# EAGLE schematic pandaLight (EAGLE 6.6.0)
DATABASE: ./../universal-eagle/partsdb.txt

## Sheet 1 of 9: Power
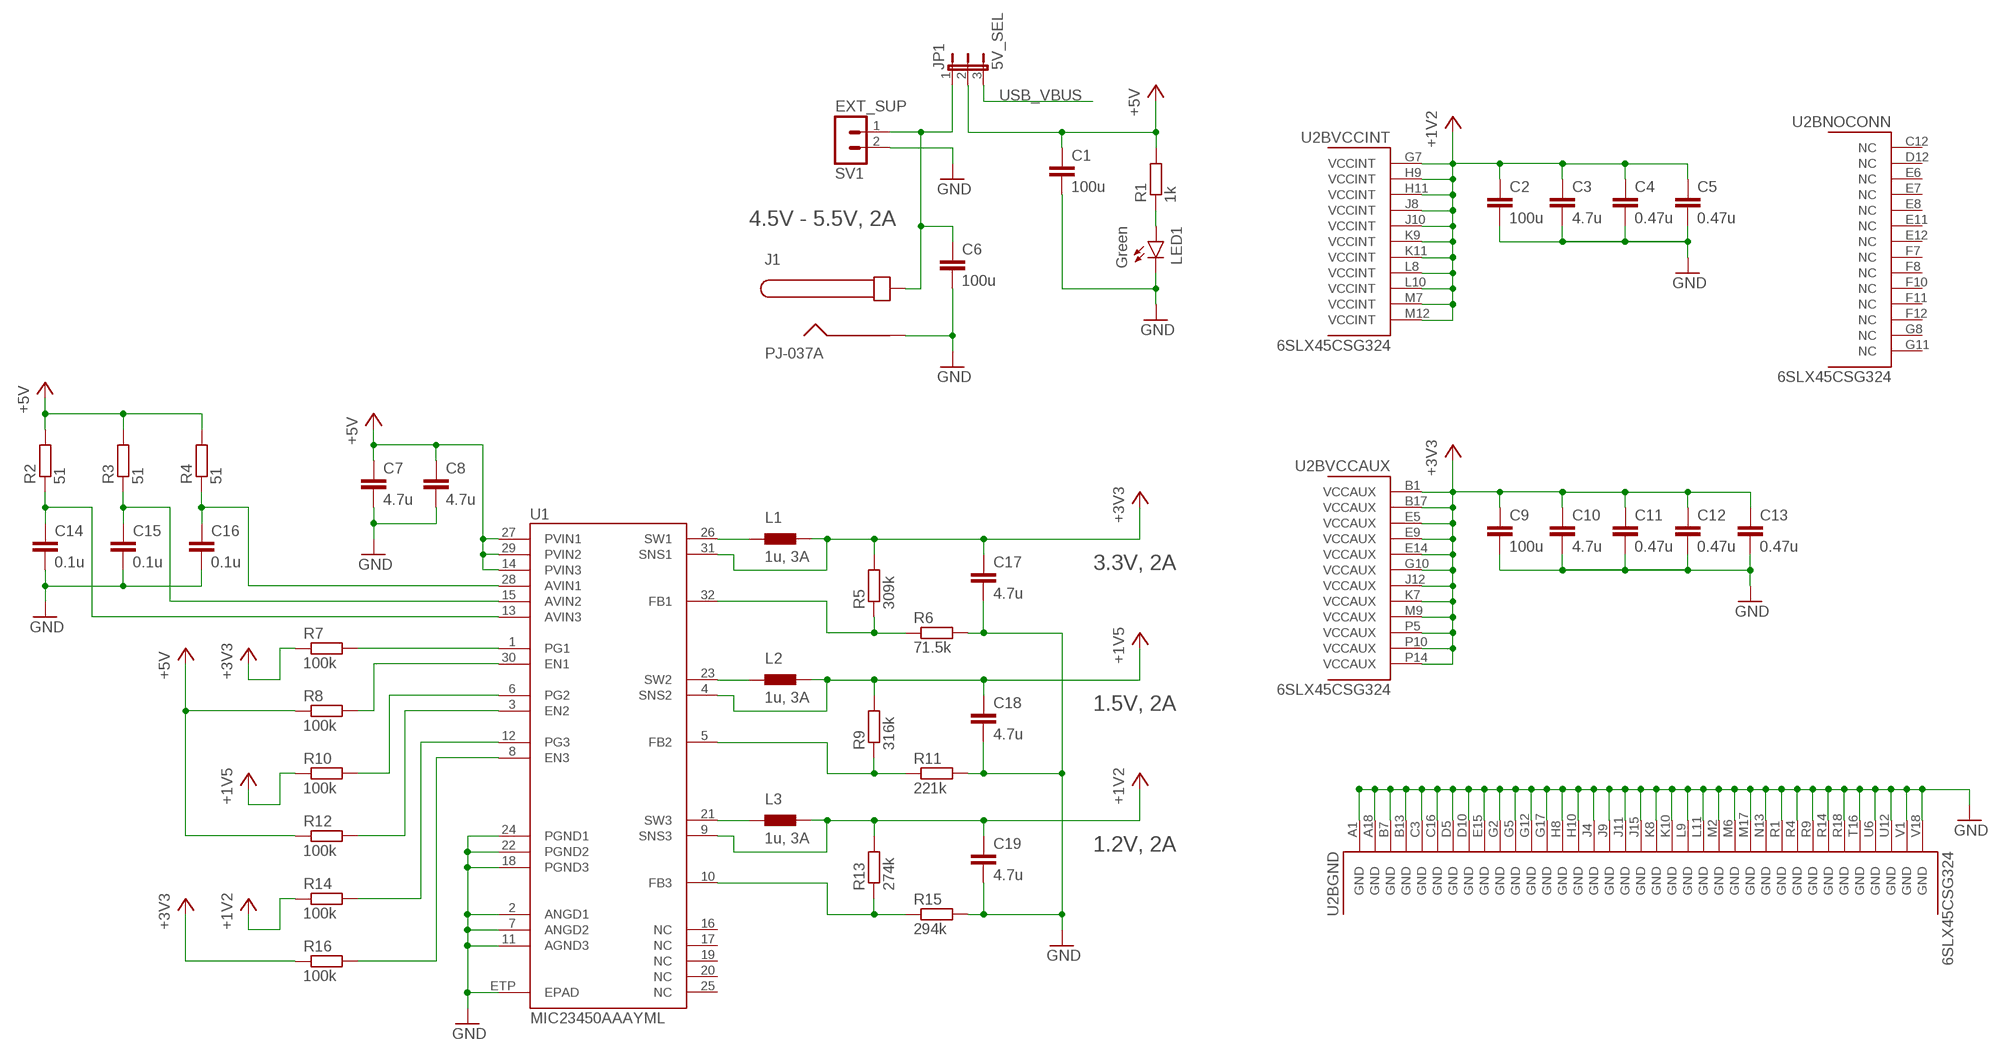
[diagram p0: schematic, sheet 1]

### Parts
C1  100u  CAPACITOR1206  [1206]
C2  100u  CAPACITOR1206  [1206]
C3  4.7u  CAPACITOR0603  [0603]
C4  0.47u  CAPACITOR0402  [0402]
C5  0.47u  CAPACITOR0402  [0402]
C6  100u  CAPACITOR1206  [1206]
C7  4.7u  CAPACITOR0603  [0603]
C8  4.7u  CAPACITOR0603  [0603]
C9  100u  CAPACITOR1206  [1206]
C10  4.7u  CAPACITOR0603  [0603]
C11  0.47u  CAPACITOR0402  [0402]
C12  0.47u  CAPACITOR0402  [0402]
C13  0.47u  CAPACITOR0402  [0402]
C14  0.1u  CAPACITOR0402  [0402]
C15  0.1u  CAPACITOR0402  [0402]
C16  0.1u  CAPACITOR0402  [0402]
C17  4.7u  CAPACITOR0603  [0603]
C18  4.7u  CAPACITOR0603  [0603]
C19  4.7u  CAPACITOR0603  [0603]
J1  PJ-037A  [PJ-037A]
JP1  5V_SEL  JP2E  [JP2]
L1  1u, 3A  INDUCTOR1008  [1008]
L2  1u, 3A  INDUCTOR1008  [1008]
L3  1u, 3A  INDUCTOR1008  [1008]
LED1  Green  LED0603  [LED-0603]
R1  1k  RESISTOR0402  [0402]
R2  51  RESISTOR0402  [0402]
R3  51  RESISTOR0402  [0402]
R4  51  RESISTOR0402  [0402]
R5  309k  RESISTOR0402  [0402]
R6  71.5k  RESISTOR0402  [0402]
R7  100k  RESISTOR0402  [0402]
R8  100k  RESISTOR0402  [0402]
R9  316k  RESISTOR0402  [0402]
R10  100k  RESISTOR0402  [0402]
R11  221k  RESISTOR0402  [0402]
R12  100k  RESISTOR0402  [0402]
R13  274k  RESISTOR0402  [0402]
R14  100k  RESISTOR0402  [0402]
R15  294k  RESISTOR0402  [0402]
R16  100k  RESISTOR0402  [0402]
SV1  EXT_SUP  MA02-1  [MA02-1]
U1  MIC23450AAAYML  [QFN-32-5X5]
U2  6SLX45CSG324  [CS324]

### Nets
+1V2: C2.1 C3.1 C4.1 C5.1 C19.1 L3.2 R13.2 R14.1 U1.9(SNS3) U2.G7(BVCCINT:VCCINT) U2.H9(BVCCINT:VCCINT) U2.H11(BVCCINT:VCCINT) U2.J8(BVCCINT:VCCINT) U2.J10(BVCCINT:VCCINT) U2.K9(BVCCINT:VCCINT) U2.K11(BVCCINT:VCCINT) U2.L8(BVCCINT:VCCINT) U2.L10(BVCCINT:VCCINT) U2.M7(BVCCINT:VCCINT) U2.M12(BVCCINT:VCCINT)
+1V5: C18.1 L2.2 R9.2 R10.1 U1.4(SNS2) ; also sheet 6
+3V3 [power]: C9.1 C10.1 C11.1 C12.1 C13.1 C17.1 L1.2 R5.2 R7.1 R16.1 U1.31(SNS1) U2.B1(BVCCAUX:VCCAUX) U2.B17(BVCCAUX:VCCAUX) U2.E5(BVCCAUX:VCCAUX) U2.E9(BVCCAUX:VCCAUX) U2.E14(BVCCAUX:VCCAUX) U2.G10(BVCCAUX:VCCAUX) U2.J12(BVCCAUX:VCCAUX) U2.K7(BVCCAUX:VCCAUX) U2.M9(BVCCAUX:VCCAUX) U2.P5(BVCCAUX:VCCAUX) U2.P10(BVCCAUX:VCCAUX) U2.P14(BVCCAUX:VCCAUX) ; also sheet 2,3,4,5,7,8,9
+5V [power]: C1.1 C7.1 C8.1 JP1.2 R1.2 R2.2 R3.2 R4.2 R8.1 R12.1 U1.14(PVIN3) U1.27(PVIN1) U1.29(PVIN2) ; also sheet 3,4,5,7
CENTER [power]: C6.1 J1.CENTER JP1.1 SV1.1
GND: C1.2 C2.2 C3.2 C4.2 C5.2 C6.2 C7.2 C8.2 C9.2 C10.2 C11.2 C12.2 C13.2 C14.2 C15.2 C16.2 C17.2 C18.2 C19.2 J1.BARREL LED1.C R6.2 R11.2 R15.2 SV1.2 U1.2(ANGD1) U1.7(ANGD2) U1.11(AGND3) U1.18(PGND3) U1.22(PGND2) U1.24(PGND1) U1.ETP(EPAD) U2.A1(BGND:GND) U2.A18(BGND:GND) U2.B7(BGND:GND) U2.B13(BGND:GND) U2.C3(BGND:GND) U2.C16(BGND:GND) U2.D5(BGND:GND) U2.D10(BGND:GND) U2.E15(BGND:GND) U2.G2(BGND:GND) U2.G5(BGND:GND) U2.G12(BGND:GND) U2.G17(BGND:GND) U2.H8(BGND:GND) U2.H10(BGND:GND) U2.J4(BGND:GND) U2.J9(BGND:GND) U2.J11(BGND:GND) U2.J15(BGND:GND) U2.K8(BGND:GND) U2.K10(BGND:GND) U2.L9(BGND:GND) U2.L11(BGND:GND) U2.M2(BGND:GND) U2.M6(BGND:GND) U2.M17(BGND:GND) U2.N13(BGND:GND) U2.R1(BGND:GND) U2.R4(BGND:GND) U2.R9(BGND:GND) U2.R14(BGND:GND) U2.R18(BGND:GND) U2.T16(BGND:GND) U2.U6(BGND:GND) U2.U12(BGND:GND) U2.V1(BGND:GND) U2.V18(BGND:GND) ; also sheet 2,3,4,5,6,7,8,9
N$14: L1.1 U1.26(SW1)
N$15 [power]: C16.1 R4.1 U1.28(AVIN1)
N$16: L2.1 U1.23(SW2)
N$17: L3.1 U1.21(SW3)
N$18: R13.1 R15.1 U1.10(FB3)
N$20: R10.2 U1.6(PG2)
N$21: R5.1 R6.1 U1.32(FB1)
N$22: R7.2 U1.1(PG1)
N$23: R9.1 R11.1 U1.5(FB2)
N$24: R12.2 U1.3(EN2)
N$25: R8.2 U1.30(EN1)
N$26: R14.2 U1.12(PG3)
N$27: R16.2 U1.8(EN3)
N$30 [power]: C15.1 R3.1 U1.15(AVIN2)
N$47: LED1.A R1.1
N$48 [power]: C14.1 R2.1 U1.13(AVIN3)
USB_VBUS [power]: JP1.3 ; also sheet 2
Unconnected: U1.16(NC) U1.17(NC) U1.19(NC) U1.20(NC) U1.25(NC) U2.C12(BNOCONN:NC) U2.D12(BNOCONN:NC) U2.E6(BNOCONN:NC) U2.E7(BNOCONN:NC) U2.E8(BNOCONN:NC) U2.E11(BNOCONN:NC) U2.E12(BNOCONN:NC) U2.F7(BNOCONN:NC) U2.F8(BNOCONN:NC) U2.F10(BNOCONN:NC) U2.F11(BNOCONN:NC) U2.F12(BNOCONN:NC) U2.G8(BNOCONN:NC) U2.G11(BNOCONN:NC)

### Notes on the sheet
- 4.5V - 5.5V, 2A
- 3.3V, 2A
- 1.5V, 2A
- 1.2V, 2A

## Sheet 2 of 9: USB
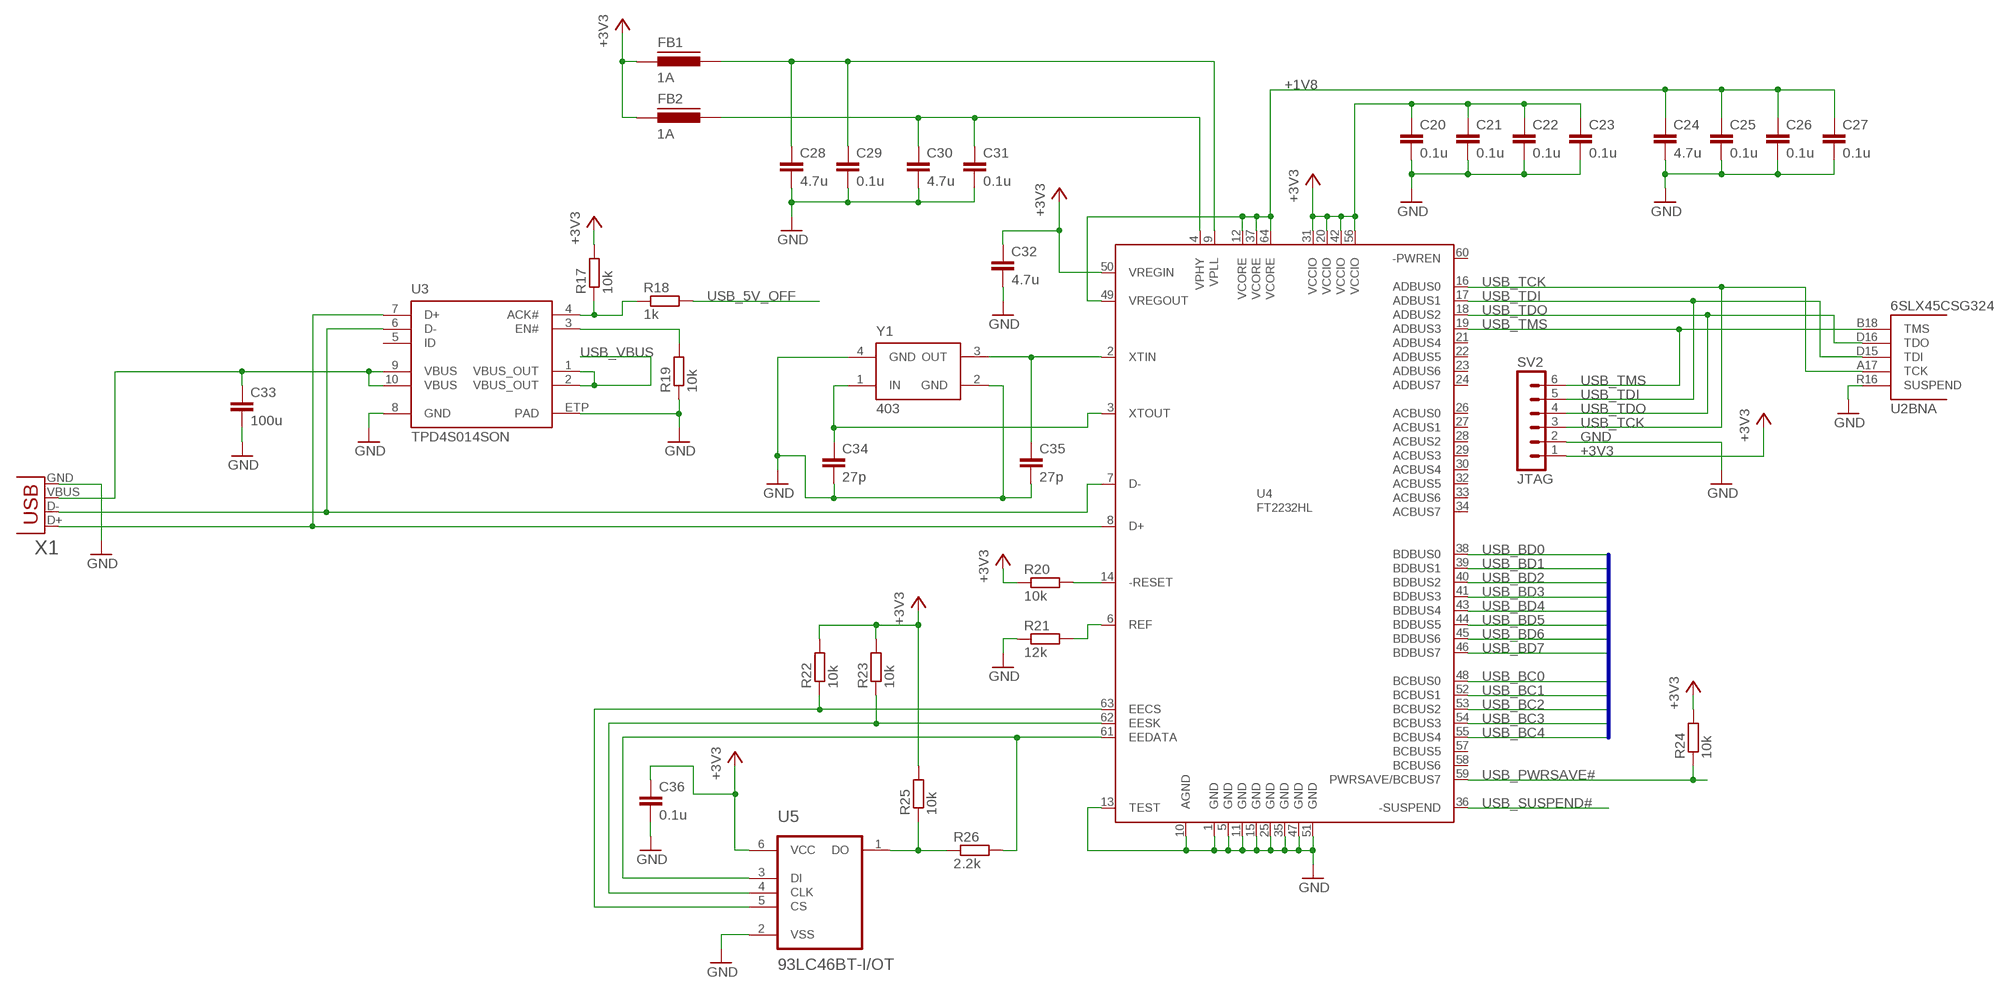
[diagram p1: schematic, sheet 2]

### Parts
C20  0.1u  CAPACITOR0402  [0402]
C21  0.1u  CAPACITOR0402  [0402]
C22  0.1u  CAPACITOR0402  [0402]
C23  0.1u  CAPACITOR0402  [0402]
C24  4.7u  CAPACITOR0603  [0603]
C25  0.1u  CAPACITOR0402  [0402]
C26  0.1u  CAPACITOR0402  [0402]
C27  0.1u  CAPACITOR0402  [0402]
C28  4.7u  CAPACITOR0603  [0603]
C29  0.1u  CAPACITOR0402  [0402]
C30  4.7u  CAPACITOR0603  [0603]
C31  0.1u  CAPACITOR0402  [0402]
C32  4.7u  CAPACITOR0603  [0603]
C33  100u  CAPACITOR1206  [1206]
C34  27p  CAPACITOR0402  [0402]
C35  27p  CAPACITOR0402  [0402]
C36  0.1u  CAPACITOR0402  [0402]
FB1  1A  FERRITE0402  [0402]
FB2  1A  FERRITE0402  [0402]
R17  10k  RESISTOR0402  [0402]
R18  1k  RESISTOR0402  [0402]
R19  10k  RESISTOR0402  [0402]
R20  10k  RESISTOR0402  [0402]
R21  12k  RESISTOR0402  [0402]
R22  10k  RESISTOR0402  [0402]
R23  10k  RESISTOR0402  [0402]
R24  10k  RESISTOR0402  [0402]
R25  10k  RESISTOR0402  [0402]
R26  2.2k  RESISTOR0402  [0402]
SV2  JTAG  MA06-1  [MA06-1]
U3  TPD4S014SON  [SON10]
U4  FT2232HL  [LQFP64]
U5  93LC46BT-I/OT  [SOT23-6]
X1  USBUB-S  [USB-UB-S]
Y1  403  [403-3.2X2.5]

### Nets
+1V8 [power]: C24.1 C25.1 C26.1 C27.1 U4.12(VCORE) U4.37(VCORE) U4.49(VREGOUT) U4.64(VCORE)
+3V3 [power]: C20.1 C21.1 C22.1 C23.1 C32.1 C36.1 FB1.1 FB2.1 R17.2 R20.1 R22.2 R23.2 R24.2 R25.2 SV2.1 U4.20(VCCIO) U4.31(VCCIO) U4.42(VCCIO) U4.50(VREGIN) U4.56(VCCIO) U5.6(VCC) ; also sheet 1,3,4,5,7,8,9
GND: C20.2 C21.2 C22.2 C23.2 C24.2 C25.2 C26.2 C27.2 C28.2 C29.2 C30.2 C31.2 C32.2 C33.2 C34.2 C35.2 C36.2 R19.1 R21.1 SV2.2 U2.R16(BNA:SUSPEND) U3.8(GND) U3.ETP(PAD) U4.1(GND) U4.5(GND) U4.10(AGND) U4.11(GND) U4.13(TEST) U4.15(GND) U4.25(GND) U4.35(GND) U4.47(GND) U4.51(GND) U5.2(VSS) X1.GND Y1.2(GND) Y1.4(GND) ; also sheet 1,3,4,5,6,7,8,9
N$1: C35.1 U4.2(XTIN) Y1.3(OUT)
N$5: C34.1 U4.3(XTOUT) Y1.1(IN)
N$6: R22.1 U4.63(EECS) U5.5(CS)
N$7: U3.6(D-) U4.7(D-) X1.D-
N$8: U3.7(D+) U4.8(D+) X1.D+
N$9: R23.1 U4.62(EESK) U5.4(CLK)
N$10: R26.2 U4.61(EEDATA) U5.3(DI)
N$11: R21.2 U4.6(REF)
N$12: R25.1 R26.1 U5.1(DO)
N$13: R20.2 U4.14(-RESET)
N$28: C30.1 C31.1 FB2.2 U4.4(VPHY)
N$31: C28.1 C29.1 FB1.2 U4.9(VPLL)
N$45 [vbus]: C33.1 U3.9(VBUS) U3.10(VBUS) X1.VBUS
USB_5V_ACK#: R17.1 R18.1 U3.4(ACK#)
USB_5V_DISABLE: R19.2 U3.3(EN#)
USB_5V_OFF: R18.2 ; also sheet 4
USB_BC0: U4.48(BCBUS0)
USB_BC1: U4.52(BCBUS1)
USB_BC2: U4.53(BCBUS2)
USB_BC3: U4.54(BCBUS3)
USB_BC4: U4.55(BCBUS4)
USB_BD0: U4.38(BDBUS0)
USB_BD1: U4.39(BDBUS1)
USB_BD2: U4.40(BDBUS2)
USB_BD3: U4.41(BDBUS3)
USB_BD4: U4.43(BDBUS4)
USB_BD5: U4.44(BDBUS5)
USB_BD6: U4.45(BDBUS6)
USB_BD7: U4.46(BDBUS7)
USB_PWRSAVE#: R24.1 U4.59(PWRSAVE/BCBUS7)
USB_SUSPEND#: U4.36(-SUSPEND) ; also sheet 4
USB_TCK: SV2.3 U2.A17(BNA:TCK) U4.16(ADBUS0)
USB_TDI: SV2.5 U2.D15(BNA:TDI) U4.17(ADBUS1)
USB_TDO: SV2.4 U2.D16(BNA:TDO) U4.18(ADBUS2)
USB_TMS: SV2.6 U2.B18(BNA:TMS) U4.19(ADBUS3)
USB_VBUS [power]: U3.1(VBUS_OUT) U3.2(VBUS_OUT) ; also sheet 1
Unconnected: U3.5(ID) U4.21(ADBUS4) U4.22(ADBUS5) U4.23(ADBUS6) U4.24(ADBUS7) U4.26(ACBUS0) U4.27(ACBUS1) U4.28(ACBUS2) U4.29(ACBUS3) U4.30(ACBUS4) U4.32(ACBUS5) U4.33(ACBUS6) U4.34(ACBUS7) U4.57(BCBUS5) U4.58(BCBUS6) U4.60(-PWREN)

### Buses
USB_BD[0..7],USB_BC[0..4]

## Sheet 3 of 9: B0, HDMI Rx0
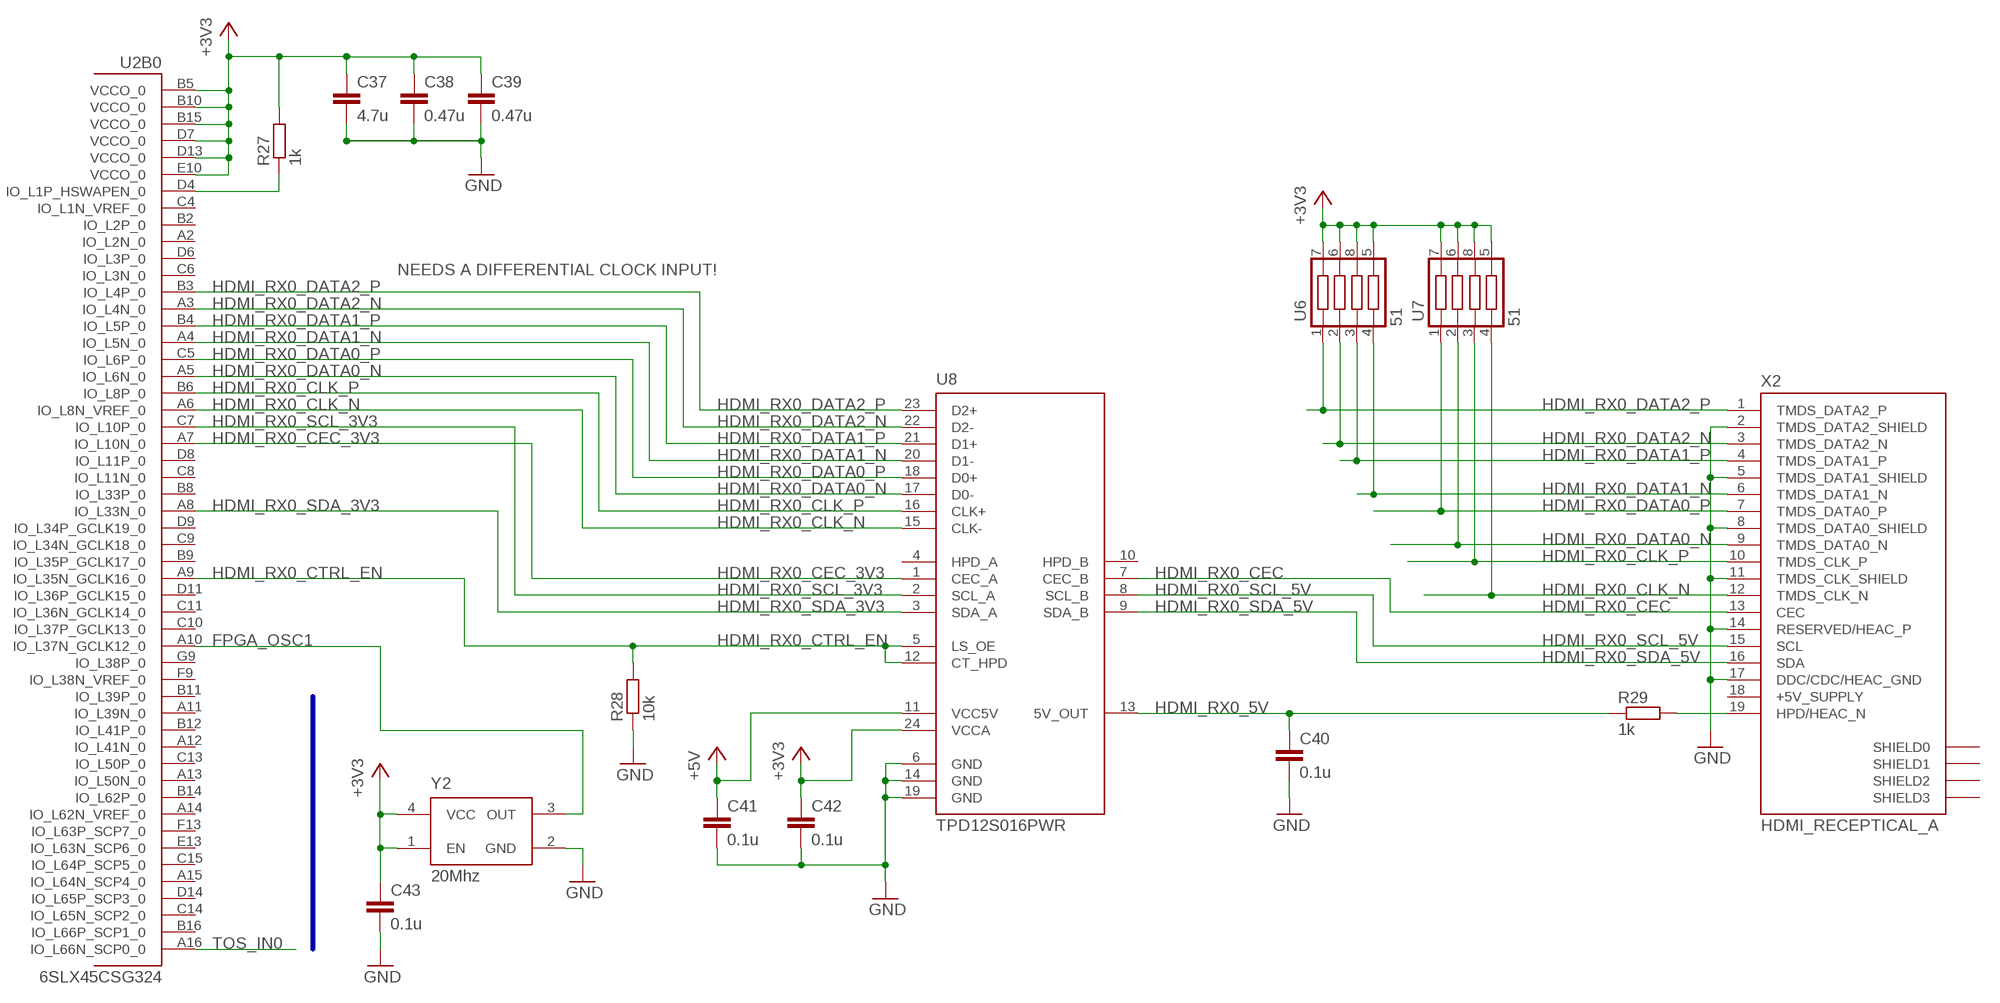
[diagram p2: schematic, sheet 3]

### Parts
C37  4.7u  CAPACITOR0603  [0603]
C38  0.47u  CAPACITOR0402  [0402]
C39  0.47u  CAPACITOR0402  [0402]
C40  0.1u  CAPACITOR0402  [0402]
C41  0.1u  CAPACITOR0402  [0402]
C42  0.1u  CAPACITOR0402  [0402]
C43  0.1u  CAPACITOR0402  [0402]
R27  1k  RESISTOR0402  [0402]
R28  10k  RESISTOR0402  [0402]
R29  1k  RESISTOR0402  [0402]
U6  51  741C083  [741C083]
U7  51  741C083  [741C083]
U8  TPD12S016PWR  [PW_R-PDSO-G24]
X2  HDMI_RECEPTICAL_A  [HDMI_TYPE_A_RECEPTICAL]
Y2  20Mhz  636  [636]

### Nets
+3V3 [power]: C37.1 C38.1 C39.1 C42.1 C43.1 R27.2 U2.B5(B0:VCCO_0) U2.B10(B0:VCCO_0) U2.B15(B0:VCCO_0) U2.D7(B0:VCCO_0) U2.D13(B0:VCCO_0) U2.E10(B0:VCCO_0) U6.5 U6.6 U6.7 U6.8(C3) U7.5 U7.6 U7.7 U7.8(C3) U8.24(VCCA) Y2.1(EN) Y2.4(VCC) ; also sheet 1,2,4,5,7,8,9
+5V [power]: C41.1 U8.11(VCC5V) ; also sheet 1,4,5,7
FPGA_OSC1: U2.A10(B0:IO_L37N_GCLK12_0) Y2.3(OUT)
GND: C37.2 C38.2 C39.2 C40.2 C41.2 C42.2 C43.2 R28.1 U8.6(GND) U8.14(GND) U8.19(GND) X2.2(TMDS_DATA2_SHIELD) X2.5(TMDS_DATA1_SHIELD) X2.8(TMDS_DATA0_SHIELD) X2.11(TMDS_CLK_SHIELD) X2.14(RESERVED/HEAC_P) X2.17(DDC/CDC/HEAC_GND) Y2.2(GND) ; also sheet 1,2,4,5,6,7,8,9
HDMI_RX0_5V: C40.1 R29.1 U8.13(5V_OUT)
HDMI_RX0_CEC: U8.7(CEC_B) X2.13(CEC)
HDMI_RX0_CEC_3V3: U2.A7(B0:IO_L10N_0) U8.1(CEC_A)
HDMI_RX0_CLK_N [tmds]: U2.A6(B0:IO_L8N_VREF_0) U7.4 U8.15(CLK-) X2.12(TMDS_CLK_N)
HDMI_RX0_CLK_P [tmds]: U2.B6(B0:IO_L8P_0) U7.3 U8.16(CLK+) X2.10(TMDS_CLK_P)
HDMI_RX0_CTRL_EN: R28.2 U2.A9(B0:IO_L35N_GCLK16_0) U8.5(LS_OE) U8.12(CT_HPD)
HDMI_RX0_DATA0_N [tmds]: U2.A5(B0:IO_L6N_0) U7.2 U8.17(D0-) X2.9(TMDS_DATA0_N)
HDMI_RX0_DATA0_P [tmds]: U2.C5(B0:IO_L6P_0) U7.1 U8.18(D0+) X2.7(TMDS_DATA0_P)
HDMI_RX0_DATA1_N [tmds]: U2.A4(B0:IO_L5N_0) U6.4 U8.20(D1-) X2.6(TMDS_DATA1_N)
HDMI_RX0_DATA1_P [tmds]: U2.B4(B0:IO_L5P_0) U6.3 U8.21(D1+) X2.4(TMDS_DATA1_P)
HDMI_RX0_DATA2_N [tmds]: U2.A3(B0:IO_L4N_0) U6.2 U8.22(D2-) X2.3(TMDS_DATA2_N)
HDMI_RX0_DATA2_P [tmds]: U2.B3(B0:IO_L4P_0) U6.1 U8.23(D2+) X2.1(TMDS_DATA2_P)
HDMI_RX0_SCL_3V3: U2.C7(B0:IO_L10P_0) U8.2(SCL_A)
HDMI_RX0_SCL_5V: U8.8(SCL_B) X2.15(SCL)
HDMI_RX0_SDA_3V3: U2.A8(B0:IO_L33N_0) U8.3(SDA_A)
HDMI_RX0_SDA_5V: U8.9(SDA_B) X2.16(SDA)
N$35: R27.1 U2.D4(B0:IO_L1P_HSWAPEN_0)
N$50: R29.2 X2.19(HPD/HEAC_N)
TOS_IN0: U2.A16(B0:IO_L66N_SCP0_0) ; also sheet 8
Unconnected: U2.A2(B0:IO_L2N_0) U2.A11(B0:IO_L39N_0) U2.A12(B0:IO_L41N_0) U2.A13(B0:IO_L50N_0) U2.A14(B0:IO_L62N_VREF_0) U2.A15(B0:IO_L64N_SCP4_0) U2.B2(B0:IO_L2P_0) U2.B8(B0:IO_L33P_0) U2.B9(B0:IO_L35P_GCLK17_0) U2.B11(B0:IO_L39P_0) U2.B12(B0:IO_L41P_0) U2.B14(B0:IO_L62P_0) U2.B16(B0:IO_L66P_SCP1_0) U2.C4(B0:IO_L1N_VREF_0) U2.C6(B0:IO_L3N_0) U2.C8(B0:IO_L11N_0) U2.C9(B0:IO_L34N_GCLK18_0) U2.C10(B0:IO_L37P_GCLK13_0) U2.C11(B0:IO_L36N_GCLK14_0) U2.C13(B0:IO_L50P_0) U2.C14(B0:IO_L65N_SCP2_0) U2.C15(B0:IO_L64P_SCP5_0) U2.D6(B0:IO_L3P_0) U2.D8(B0:IO_L11P_0) U2.D9(B0:IO_L34P_GCLK19_0) U2.D11(B0:IO_L36P_GCLK15_0) U2.D14(B0:IO_L65P_SCP3_0) U2.E13(B0:IO_L63N_SCP6_0) U2.F9(B0:IO_L38N_VREF_0) U2.F13(B0:IO_L63P_SCP7_0) U2.G9(B0:IO_L38P_0) U8.4(HPD_A) U8.10(HPD_B) X2.18(+5V_SUPPLY) X2.SHIELD0 X2.SHIELD1 X2.SHIELD2 X2.SHIELD3

### Buses
PMOD0_[0..3],PMOD1_[0..3],PMOD2_[0..3],PMOD3_[0..3]

### Notes on the sheet
- NEEDS A DIFFERENTIAL CLOCK INPUT!

## Sheet 4 of 9: B1, HDMI Rx1
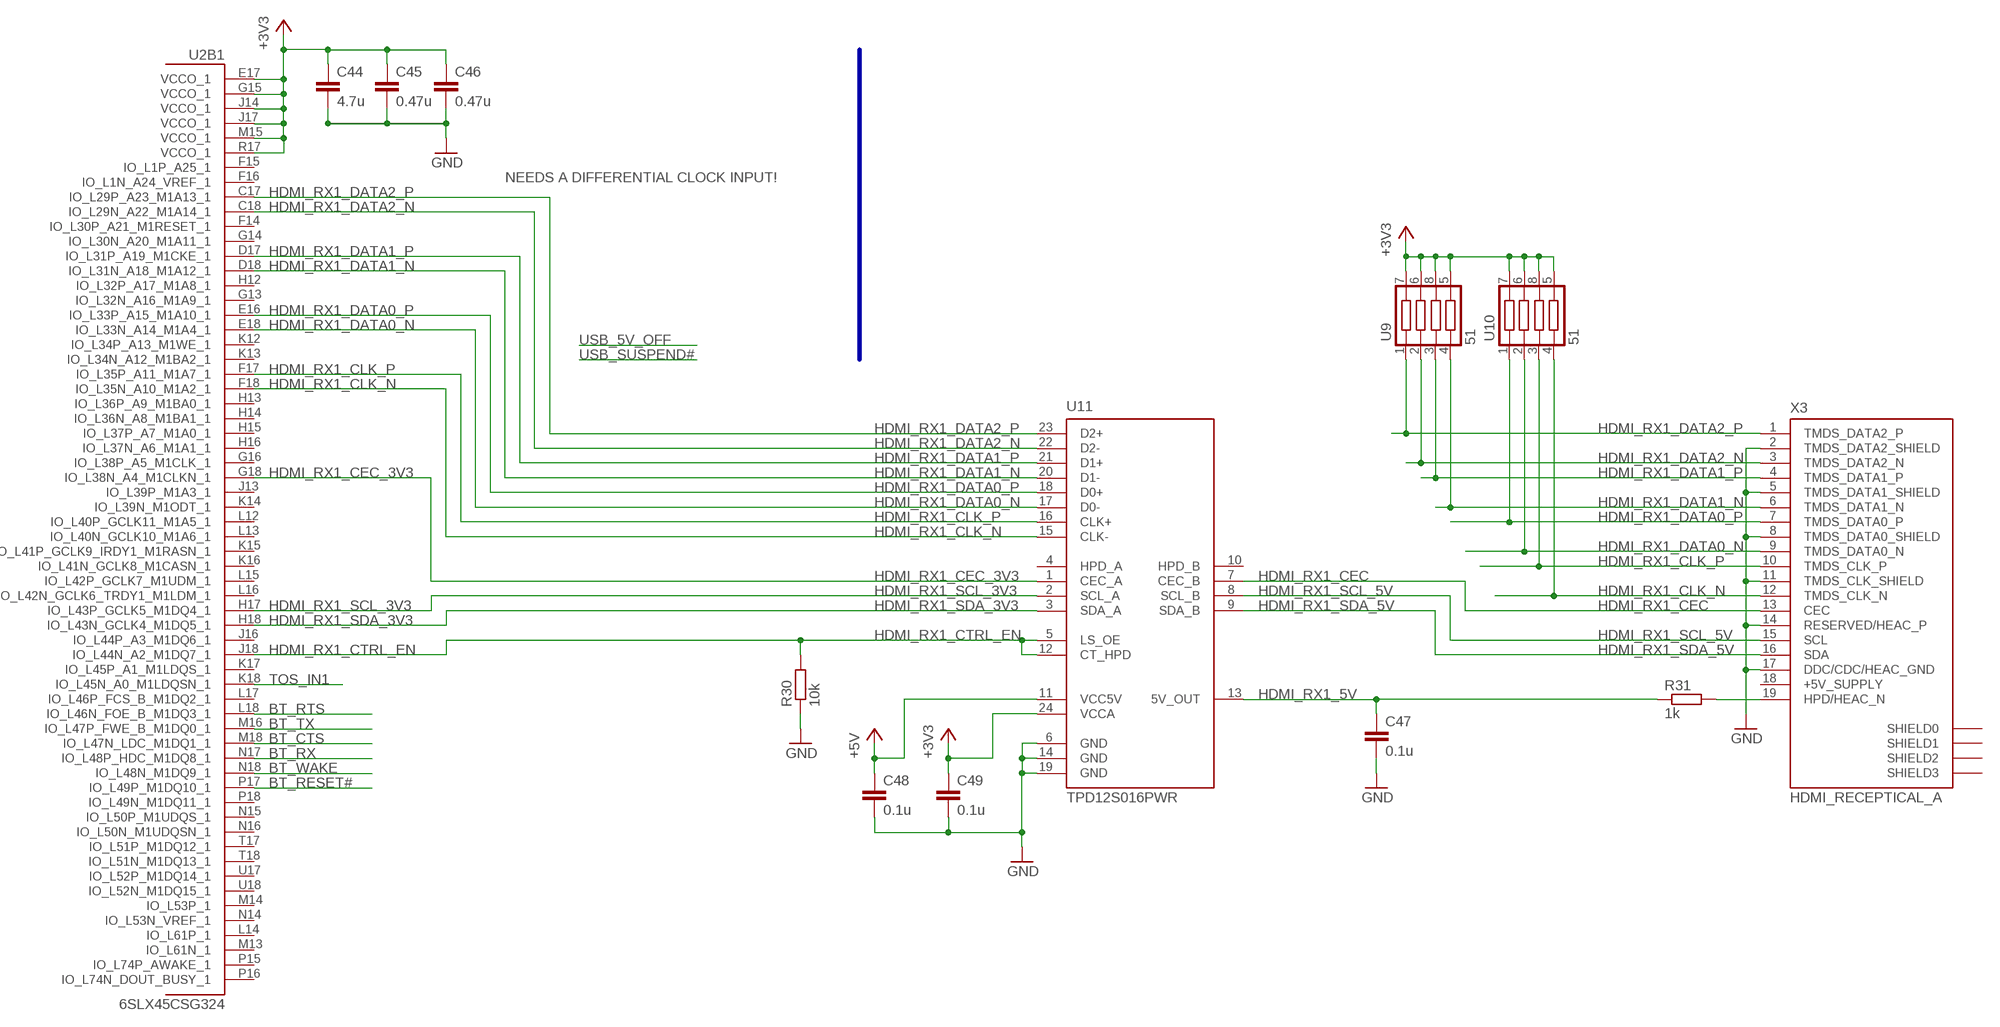
[diagram p3: schematic, sheet 4]

### Parts
C44  4.7u  CAPACITOR0603  [0603]
C45  0.47u  CAPACITOR0402  [0402]
C46  0.47u  CAPACITOR0402  [0402]
C47  0.1u  CAPACITOR0402  [0402]
C48  0.1u  CAPACITOR0402  [0402]
C49  0.1u  CAPACITOR0402  [0402]
R30  10k  RESISTOR0402  [0402]
R31  1k  RESISTOR0402  [0402]
U9  51  741C083  [741C083]
U10  51  741C083  [741C083]
U11  TPD12S016PWR  [PW_R-PDSO-G24]
X3  HDMI_RECEPTICAL_A  [HDMI_TYPE_A_RECEPTICAL]

### Nets
+3V3 [power]: C44.1 C45.1 C46.1 C49.1 U2.E17(B1:VCCO_1) U2.G15(B1:VCCO_1) U2.J14(B1:VCCO_1) U2.J17(B1:VCCO_1) U2.M15(B1:VCCO_1) U2.R17(B1:VCCO_1) U9.5 U9.6 U9.7 U9.8(C3) U10.5 U10.6 U10.7 U10.8(C3) U11.24(VCCA) ; also sheet 1,2,3,5,7,8,9
+5V [power]: C48.1 U11.11(VCC5V) ; also sheet 1,3,5,7
BT_CTS: U2.M18(B1:IO_L47N_LDC_M1DQ1_1) ; also sheet 9
BT_RESET#: U2.P17(B1:IO_L49P_M1DQ10_1) ; also sheet 9
BT_RTS: U2.L18(B1:IO_L46N_FOE_B_M1DQ3_1) ; also sheet 9
BT_RX: U2.N17(B1:IO_L48P_HDC_M1DQ8_1) ; also sheet 9
BT_TX: U2.M16(B1:IO_L47P_FWE_B_M1DQ0_1) ; also sheet 9
BT_WAKE: U2.N18(B1:IO_L48N_M1DQ9_1) ; also sheet 9
GND: C44.2 C45.2 C46.2 C47.2 C48.2 C49.2 R30.1 U11.6(GND) U11.14(GND) U11.19(GND) X3.2(TMDS_DATA2_SHIELD) X3.5(TMDS_DATA1_SHIELD) X3.8(TMDS_DATA0_SHIELD) X3.11(TMDS_CLK_SHIELD) X3.14(RESERVED/HEAC_P) X3.17(DDC/CDC/HEAC_GND) ; also sheet 1,2,3,5,6,7,8,9
HDMI_RX1_5V: C47.1 R31.1 U11.13(5V_OUT)
HDMI_RX1_CEC: U11.7(CEC_B) X3.13(CEC)
HDMI_RX1_CEC_3V3: U2.G18(B1:IO_L38N_A4_M1CLKN_1) U11.1(CEC_A)
HDMI_RX1_CLK_N [tmds]: U2.F18(B1:IO_L35N_A10_M1A2_1) U10.4 U11.15(CLK-) X3.12(TMDS_CLK_N)
HDMI_RX1_CLK_P [tmds]: U2.F17(B1:IO_L35P_A11_M1A7_1) U10.3 U11.16(CLK+) X3.10(TMDS_CLK_P)
HDMI_RX1_CTRL_EN: R30.2 U2.J18(B1:IO_L44N_A2_M1DQ7_1) U11.5(LS_OE) U11.12(CT_HPD)
HDMI_RX1_DATA0_N [tmds]: U2.E18(B1:IO_L33N_A14_M1A4_1) U10.2 U11.17(D0-) X3.9(TMDS_DATA0_N)
HDMI_RX1_DATA0_P [tmds]: U2.E16(B1:IO_L33P_A15_M1A10_1) U10.1 U11.18(D0+) X3.7(TMDS_DATA0_P)
HDMI_RX1_DATA1_N [tmds]: U2.D18(B1:IO_L31N_A18_M1A12_1) U9.4 U11.20(D1-) X3.6(TMDS_DATA1_N)
HDMI_RX1_DATA1_P [tmds]: U2.D17(B1:IO_L31P_A19_M1CKE_1) U9.3 U11.21(D1+) X3.4(TMDS_DATA1_P)
HDMI_RX1_DATA2_N [tmds]: U2.C18(B1:IO_L29N_A22_M1A14_1) U9.2 U11.22(D2-) X3.3(TMDS_DATA2_N)
HDMI_RX1_DATA2_P [tmds]: U2.C17(B1:IO_L29P_A23_M1A13_1) U9.1 U11.23(D2+) X3.1(TMDS_DATA2_P)
HDMI_RX1_SCL_3V3: U2.H17(B1:IO_L43P_GCLK5_M1DQ4_1) U11.2(SCL_A)
HDMI_RX1_SCL_5V: U11.8(SCL_B) X3.15(SCL)
HDMI_RX1_SDA_3V3: U2.H18(B1:IO_L43N_GCLK4_M1DQ5_1) U11.3(SDA_A)
HDMI_RX1_SDA_5V: U11.9(SDA_B) X3.16(SDA)
N$37: R31.2 X3.19(HPD/HEAC_N)
TOS_IN1: U2.K18(B1:IO_L45N_A0_M1LDQSN_1) ; also sheet 8
Unconnected: U2.F14(B1:IO_L30P_A21_M1RESET_1) U2.F15(B1:IO_L1P_A25_1) U2.F16(B1:IO_L1N_A24_VREF_1) U2.G13(B1:IO_L32N_A16_M1A9_1) U2.G14(B1:IO_L30N_A20_M1A11_1) U2.G16(B1:IO_L38P_A5_M1CLK_1) U2.H12(B1:IO_L32P_A17_M1A8_1) U2.H13(B1:IO_L36P_A9_M1BA0_1) U2.H14(B1:IO_L36N_A8_M1BA1_1) U2.H15(B1:IO_L37P_A7_M1A0_1) U2.H16(B1:IO_L37N_A6_M1A1_1) U2.J13(B1:IO_L39P_M1A3_1) U2.J16(B1:IO_L44P_A3_M1DQ6_1) U2.K12(B1:IO_L34P_A13_M1WE_1) U2.K13(B1:IO_L34N_A12_M1BA2_1) U2.K14(B1:IO_L39N_M1ODT_1) U2.K15(B1:IO_L41P_GCLK9_IRDY1_M1RASN_1) U2.K16(B1:IO_L41N_GCLK8_M1CASN_1) U2.K17(B1:IO_L45P_A1_M1LDQS_1) U2.L12(B1:IO_L40P_GCLK11_M1A5_1) U2.L13(B1:IO_L40N_GCLK10_M1A6_1) U2.L14(B1:IO_L61P_1) U2.L15(B1:IO_L42P_GCLK7_M1UDM_1) U2.L16(B1:IO_L42N_GCLK6_TRDY1_M1LDM_1) U2.L17(B1:IO_L46P_FCS_B_M1DQ2_1) U2.M13(B1:IO_L61N_1) U2.M14(B1:IO_L53P_1) U2.N14(B1:IO_L53N_VREF_1) U2.N15(B1:IO_L50P_M1UDQS_1) U2.N16(B1:IO_L50N_M1UDQSN_1) U2.P15(B1:IO_L74P_AWAKE_1) U2.P16(B1:IO_L74N_DOUT_BUSY_1) U2.P18(B1:IO_L49N_M1DQ11_1) U2.T17(B1:IO_L51P_M1DQ12_1) U2.T18(B1:IO_L51N_M1DQ13_1) U2.U17(B1:IO_L52P_M1DQ14_1) U2.U18(B1:IO_L52N_M1DQ15_1) U11.4(HPD_A) U11.10(HPD_B) X3.18(+5V_SUPPLY) X3.SHIELD0 X3.SHIELD1 X3.SHIELD2 X3.SHIELD3

### Buses
USB_BD[0..7],USB_BC[0..4]

### Notes on the sheet
- NEEDS A DIFFERENTIAL CLOCK INPUT!

## Sheet 5 of 9: B2, HDMI Tx0
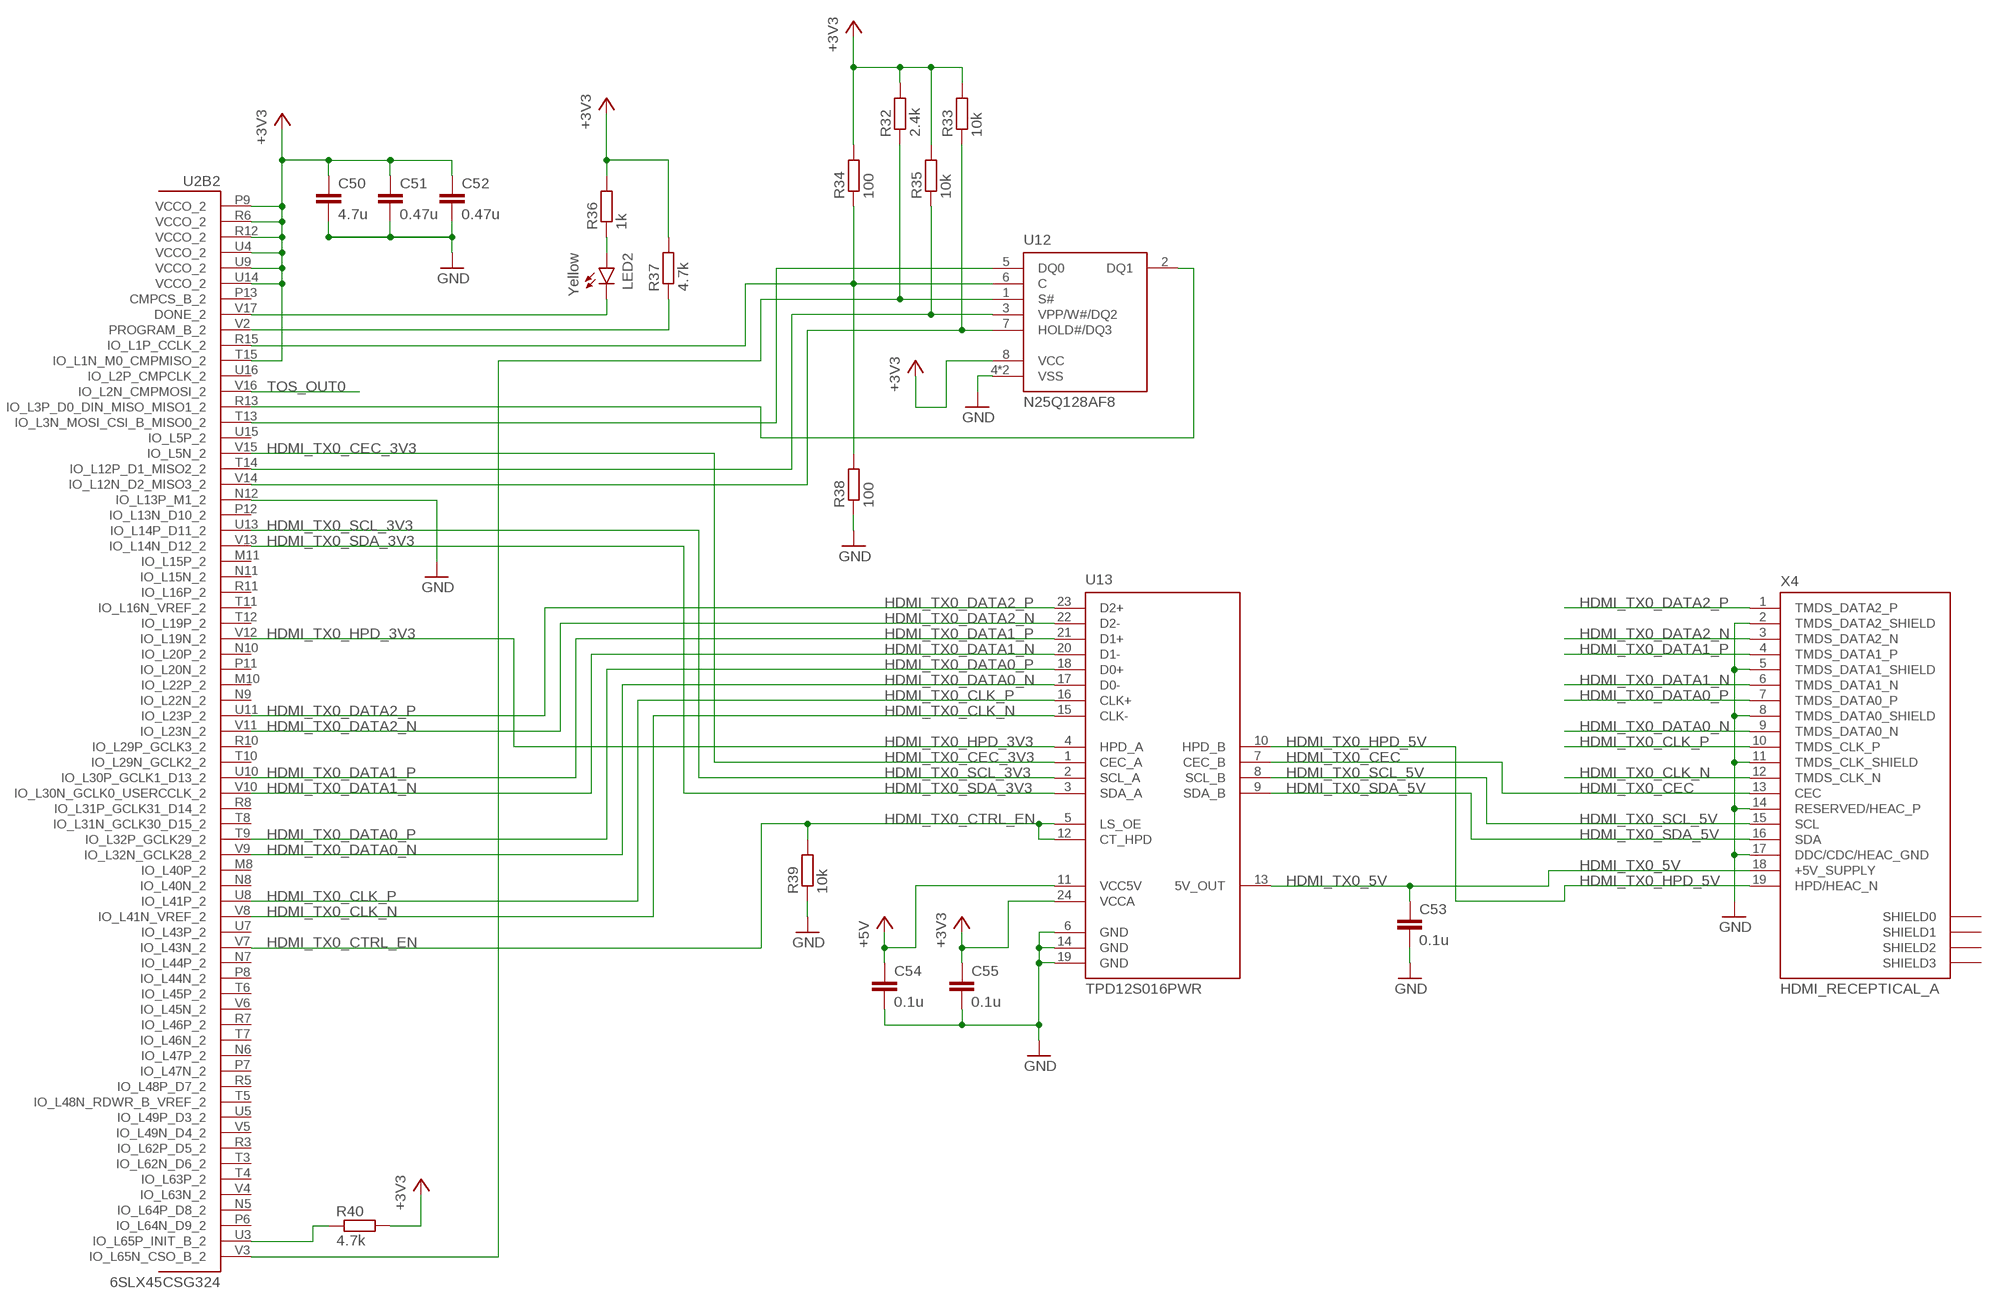
[diagram p4: schematic, sheet 5]

### Parts
C50  4.7u  CAPACITOR0603  [0603]
C51  0.47u  CAPACITOR0402  [0402]
C52  0.47u  CAPACITOR0402  [0402]
C53  0.1u  CAPACITOR0402  [0402]
C54  0.1u  CAPACITOR0402  [0402]
C55  0.1u  CAPACITOR0402  [0402]
LED2  Yellow  LED0603  [LED-0603]
R32  2.4k  RESISTOR0402  [0402]
R33  10k  RESISTOR0402  [0402]
R34  100  RESISTOR0402  [0402]
R35  10k  RESISTOR0402  [0402]
R36  1k  RESISTOR0402  [0402]
R37  4.7k  RESISTOR0402  [0402]
R38  100  RESISTOR0402  [0402]
R39  10k  RESISTOR0402  [0402]
R40  4.7k  RESISTOR0402  [0402]
U12  N25Q128AF8  [V-PDFN-8_8X6]
U13  TPD12S016PWR  [PW_R-PDSO-G24]
X4  HDMI_RECEPTICAL_A  [HDMI_TYPE_A_RECEPTICAL]

### Nets
+3V3 [power]: C50.1 C51.1 C52.1 C55.1 R32.2 R33.2 R34.2 R35.2 R36.2 R37.2 R40.2 U2.P9(B2:VCCO_2) U2.R6(B2:VCCO_2) U2.R12(B2:VCCO_2) U2.T15(B2:IO_L1N_M0_CMPMISO_2) U2.U4(B2:VCCO_2) U2.U9(B2:VCCO_2) U2.U14(B2:VCCO_2) U12.8(VCC) U13.24(VCCA) ; also sheet 1,2,3,4,7,8,9
+5V [power]: C54.1 U13.11(VCC5V) ; also sheet 1,3,4,7
GND: C50.2 C51.2 C52.2 C53.2 C54.2 C55.2 R38.1 R39.1 U2.N12(B2:IO_L13P_M1_2) U12.4(VSS) U12.ETP(VSS) U13.6(GND) U13.14(GND) U13.19(GND) X4.2(TMDS_DATA2_SHIELD) X4.5(TMDS_DATA1_SHIELD) X4.8(TMDS_DATA0_SHIELD) X4.11(TMDS_CLK_SHIELD) X4.14(RESERVED/HEAC_P) X4.17(DDC/CDC/HEAC_GND) ; also sheet 1,2,3,4,6,7,8,9
HDMI_TX0_5V [power]: C53.1 U13.13(5V_OUT) X4.18(+5V_SUPPLY)
HDMI_TX0_CEC: U13.7(CEC_B) X4.13(CEC)
HDMI_TX0_CEC_3V3: U2.V15(B2:IO_L5N_2) U13.1(CEC_A)
HDMI_TX0_CLK_N [tmds]: U2.V8(B2:IO_L41N_VREF_2) U13.15(CLK-) X4.12(TMDS_CLK_N)
HDMI_TX0_CLK_P [tmds]: U2.U8(B2:IO_L41P_2) U13.16(CLK+) X4.10(TMDS_CLK_P)
HDMI_TX0_CTRL_EN: R39.2 U2.V7(B2:IO_L43N_2) U13.5(LS_OE) U13.12(CT_HPD)
HDMI_TX0_DATA0_N [tmds]: U2.V9(B2:IO_L32N_GCLK28_2) U13.17(D0-) X4.9(TMDS_DATA0_N)
HDMI_TX0_DATA0_P [tmds]: U2.T9(B2:IO_L32P_GCLK29_2) U13.18(D0+) X4.7(TMDS_DATA0_P)
HDMI_TX0_DATA1_N [tmds]: U2.V10(B2:IO_L30N_GCLK0_USERCCLK_2) U13.20(D1-) X4.6(TMDS_DATA1_N)
HDMI_TX0_DATA1_P [tmds]: U2.U10(B2:IO_L30P_GCLK1_D13_2) U13.21(D1+) X4.4(TMDS_DATA1_P)
HDMI_TX0_DATA2_N [tmds]: U2.V11(B2:IO_L23N_2) U13.22(D2-) X4.3(TMDS_DATA2_N)
HDMI_TX0_DATA2_P [tmds]: U2.U11(B2:IO_L23P_2) U13.23(D2+) X4.1(TMDS_DATA2_P)
HDMI_TX0_HPD_3V3: U2.V12(B2:IO_L19N_2) U13.4(HPD_A)
HDMI_TX0_HPD_5V: U13.10(HPD_B) X4.19(HPD/HEAC_N)
HDMI_TX0_SCL_3V3: U2.U13(B2:IO_L14P_D11_2) U13.2(SCL_A)
HDMI_TX0_SCL_5V: U13.8(SCL_B) X4.15(SCL)
HDMI_TX0_SDA_3V3: U2.V13(B2:IO_L14N_D12_2) U13.3(SDA_A)
HDMI_TX0_SDA_5V: U13.9(SDA_B) X4.16(SDA)
N$33: LED2.C U2.V17(B2:DONE_2)
N$34: R37.1 U2.V2(B2:PROGRAM_B_2)
N$38: LED2.A R36.1
N$39: R40.1 U2.U3(B2:IO_L65P_INIT_B_2)
N$40: U2.T13(B2:IO_L3N_MOSI_CSI_B_MISO0_2) U12.5(DQ0)
N$41: R32.1 U2.V3(B2:IO_L65N_CSO_B_2) U12.1(S#)
N$42: R34.1 R38.2 U2.R15(B2:IO_L1P_CCLK_2) U12.6(C)
N$43: U2.R13(B2:IO_L3P_D0_DIN_MISO_MISO1_2) U12.2(DQ1)
N$44: R35.1 U2.T14(B2:IO_L12P_D1_MISO2_2) U12.3(VPP/W#/DQ2)
N$46: R33.1 U2.V14(B2:IO_L12N_D2_MISO3_2) U12.7(HOLD#/DQ3)
TOS_OUT0: U2.V16(B2:IO_L2N_CMPMOSI_2) ; also sheet 8
Unconnected: U2.M8(B2:IO_L40P_2) U2.M10(B2:IO_L22P_2) U2.M11(B2:IO_L15P_2) U2.N5(B2:IO_L64P_D8_2) U2.N6(B2:IO_L47P_2) U2.N7(B2:IO_L44P_2) U2.N8(B2:IO_L40N_2) U2.N9(B2:IO_L22N_2) U2.N10(B2:IO_L20P_2) U2.N11(B2:IO_L15N_2) U2.P6(B2:IO_L64N_D9_2) U2.P7(B2:IO_L47N_2) U2.P8(B2:IO_L44N_2) U2.P11(B2:IO_L20N_2) U2.P12(B2:IO_L13N_D10_2) U2.P13(B2:CMPCS_B_2) U2.R3(B2:IO_L62P_D5_2) U2.R5(B2:IO_L48P_D7_2) U2.R7(B2:IO_L46P_2) U2.R8(B2:IO_L31P_GCLK31_D14_2) U2.R10(B2:IO_L29P_GCLK3_2) U2.R11(B2:IO_L16P_2) U2.T3(B2:IO_L62N_D6_2) U2.T4(B2:IO_L63P_2) U2.T5(B2:IO_L48N_RDWR_B_VREF_2) U2.T6(B2:IO_L45P_2) U2.T7(B2:IO_L46N_2) U2.T8(B2:IO_L31N_GCLK30_D15_2) U2.T10(B2:IO_L29N_GCLK2_2) U2.T11(B2:IO_L16N_VREF_2) U2.T12(B2:IO_L19P_2) U2.U5(B2:IO_L49P_D3_2) U2.U7(B2:IO_L43P_2) U2.U15(B2:IO_L5P_2) U2.U16(B2:IO_L2P_CMPCLK_2) U2.V4(B2:IO_L63N_2) U2.V5(B2:IO_L49N_D4_2) U2.V6(B2:IO_L45N_2) X4.SHIELD0 X4.SHIELD1 X4.SHIELD2 X4.SHIELD3

## Sheet 6 of 9: B3, DDR3
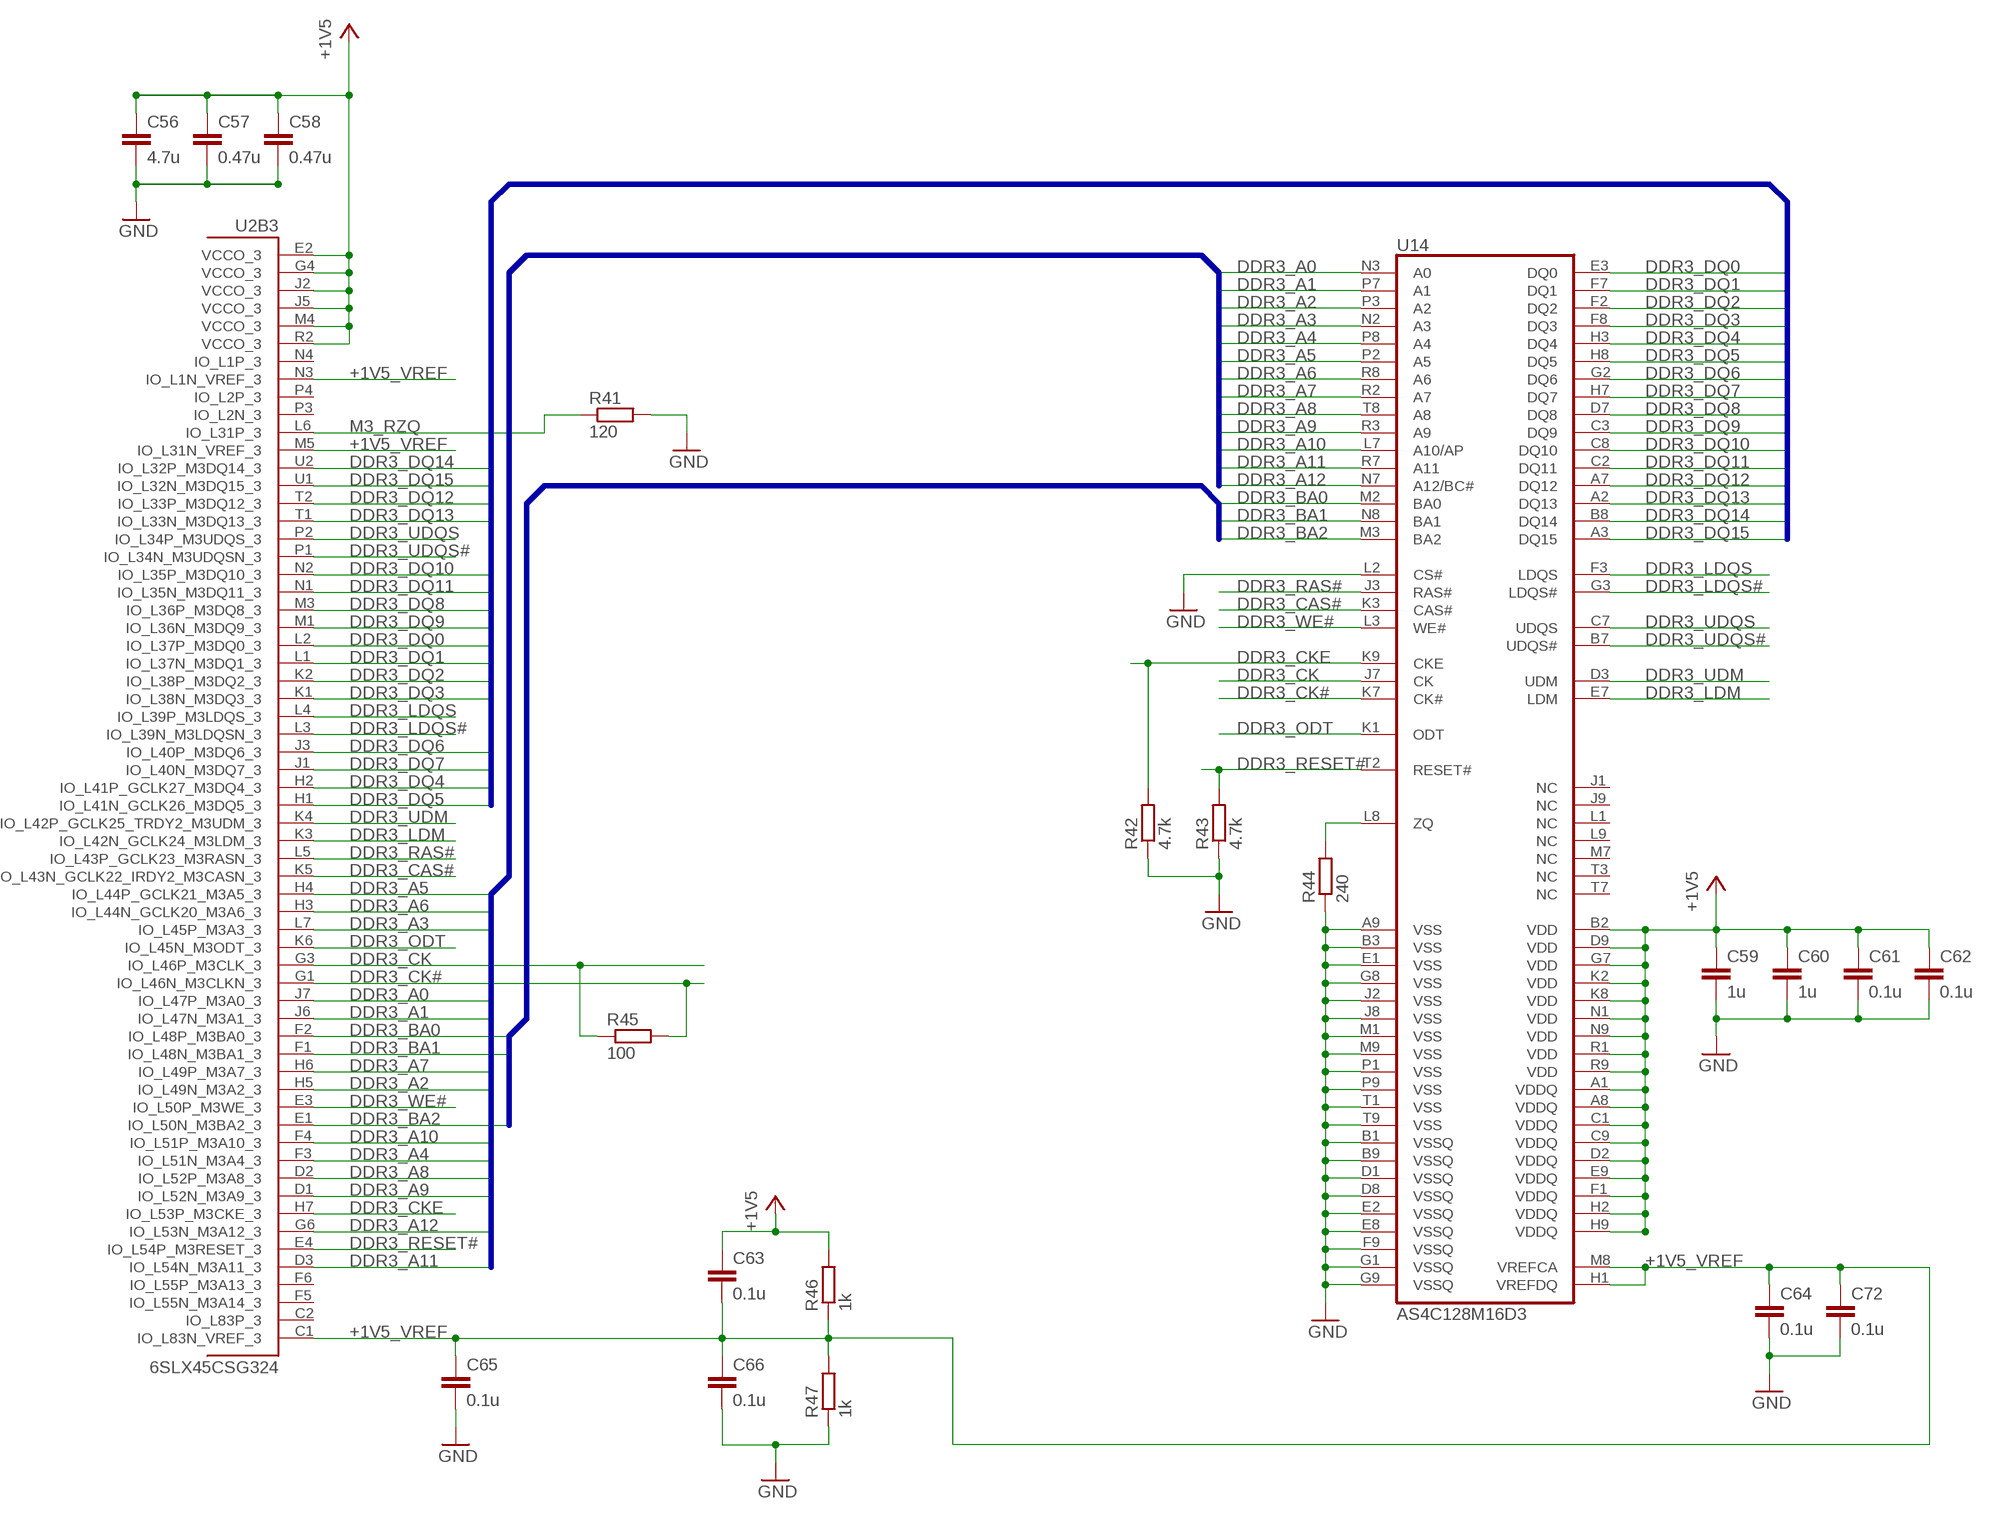
[diagram p5: schematic, sheet 6]

### Parts
C56  4.7u  CAPACITOR0603  [0603]
C57  0.47u  CAPACITOR0402  [0402]
C58  0.47u  CAPACITOR0402  [0402]
C59  1u  CAPACITOR0402  [0402]
C60  1u  CAPACITOR0402  [0402]
C61  0.1u  CAPACITOR0402  [0402]
C62  0.1u  CAPACITOR0402  [0402]
C63  0.1u  CAPACITOR0402  [0402]
C64  0.1u  CAPACITOR0402  [0402]
C65  0.1u  CAPACITOR0402  [0402]
C66  0.1u  CAPACITOR0402  [0402]
C72  0.1u  CAPACITOR0402  [0402]
R41  120  RESISTOR0402  [0402]
R42  4.7k  RESISTOR0402  [0402]
R43  4.7k  RESISTOR0402  [0402]
R44  240  RESISTOR0402  [0402]
R45  100  RESISTOR0402  [0402]
R46  1k  RESISTOR0402  [0402]
R47  1k  RESISTOR0402  [0402]
U14  AS4C128M16D3  [96-FBGA_13X9]

### Nets
+1V5: C56.1 C57.1 C58.1 C59.1 C60.1 C61.1 C62.1 C63.1 R46.2 U2.E2(B3:VCCO_3) U2.G4(B3:VCCO_3) U2.J2(B3:VCCO_3) U2.J5(B3:VCCO_3) U2.M4(B3:VCCO_3) U2.R2(B3:VCCO_3) U14.A1(VDDQ) U14.A8(VDDQ) U14.B2(VDD) U14.C1(VDDQ) U14.C9(VDDQ) U14.D2(VDDQ) U14.D9(VDD) U14.E9(VDDQ) U14.F1(VDDQ) U14.G7(VDD) U14.H2(VDDQ) U14.H9(VDDQ) U14.K2(VDD) U14.K8(VDD) U14.N1(VDD) U14.N9(VDD) U14.R1(VDD) U14.R9(VDD) ; also sheet 1
+1V5_VREF [ddr3_vref]: C63.2 C64.1 C65.1 C66.1 C72.1 R46.1 R47.2 U2.C1(B3:IO_L83N_VREF_3) U2.M5(B3:IO_L31N_VREF_3) U2.N3(B3:IO_L1N_VREF_3) U14.H1(VREFDQ) U14.M8(VREFCA)
DDR3_A0: U2.J7(B3:IO_L47P_M3A0_3) U14.N3(A0)
DDR3_A1: U2.J6(B3:IO_L47N_M3A1_3) U14.P7(A1)
DDR3_A2: U2.H5(B3:IO_L49N_M3A2_3) U14.P3(A2)
DDR3_A3: U2.L7(B3:IO_L45P_M3A3_3) U14.N2(A3)
DDR3_A4: U2.F3(B3:IO_L51N_M3A4_3) U14.P8(A4)
DDR3_A5: U2.H4(B3:IO_L44P_GCLK21_M3A5_3) U14.P2(A5)
DDR3_A6: U2.H3(B3:IO_L44N_GCLK20_M3A6_3) U14.R8(A6)
DDR3_A7: U2.H6(B3:IO_L49P_M3A7_3) U14.R2(A7)
DDR3_A8: U2.D2(B3:IO_L52P_M3A8_3) U14.T8(A8)
DDR3_A9: U2.D1(B3:IO_L52N_M3A9_3) U14.R3(A9)
DDR3_A10: U2.F4(B3:IO_L51P_M3A10_3) U14.L7(A10/AP)
DDR3_A11: U2.D3(B3:IO_L54N_M3A11_3) U14.R7(A11)
DDR3_A12: U2.G6(B3:IO_L53N_M3A12_3) U14.N7(A12/BC#)
DDR3_BA0: U2.F2(B3:IO_L48P_M3BA0_3) U14.M2(BA0)
DDR3_BA1: U2.F1(B3:IO_L48N_M3BA1_3) U14.N8(BA1)
DDR3_BA2: U2.E1(B3:IO_L50N_M3BA2_3) U14.M3(BA2)
DDR3_CAS#: U2.K5(B3:IO_L43N_GCLK22_IRDY2_M3CASN_3) U14.K3(CAS#)
DDR3_CK: R45.1 U2.G3(B3:IO_L46P_M3CLK_3) U14.J7(CK)
DDR3_CK#: R45.2 U2.G1(B3:IO_L46N_M3CLKN_3) U14.K7(CK#)
DDR3_CKE: R42.2 U2.H7(B3:IO_L53P_M3CKE_3) U14.K9(CKE)
DDR3_DQ0: U2.L2(B3:IO_L37P_M3DQ0_3) U14.E3(DQ0)
DDR3_DQ1: U2.L1(B3:IO_L37N_M3DQ1_3) U14.F7(DQ1)
DDR3_DQ2: U2.K2(B3:IO_L38P_M3DQ2_3) U14.F2(DQ2)
DDR3_DQ3: U2.K1(B3:IO_L38N_M3DQ3_3) U14.F8(DQ3)
DDR3_DQ4: U2.H2(B3:IO_L41P_GCLK27_M3DQ4_3) U14.H3(DQ4)
DDR3_DQ5: U2.H1(B3:IO_L41N_GCLK26_M3DQ5_3) U14.H8(DQ5)
DDR3_DQ6: U2.J3(B3:IO_L40P_M3DQ6_3) U14.G2(DQ6)
DDR3_DQ7: U2.J1(B3:IO_L40N_M3DQ7_3) U14.H7(DQ7)
DDR3_DQ8: U2.M3(B3:IO_L36P_M3DQ8_3) U14.D7(DQ8)
DDR3_DQ9: U2.M1(B3:IO_L36N_M3DQ9_3) U14.C3(DQ9)
DDR3_DQ10: U2.N2(B3:IO_L35P_M3DQ10_3) U14.C8(DQ10)
DDR3_DQ11: U2.N1(B3:IO_L35N_M3DQ11_3) U14.C2(DQ11)
DDR3_DQ12: U2.T2(B3:IO_L33P_M3DQ12_3) U14.A7(DQ12)
DDR3_DQ13: U2.T1(B3:IO_L33N_M3DQ13_3) U14.A2(DQ13)
DDR3_DQ14: U2.U2(B3:IO_L32P_M3DQ14_3) U14.B8(DQ14)
DDR3_DQ15: U2.U1(B3:IO_L32N_M3DQ15_3) U14.A3(DQ15)
DDR3_LDM: U2.K3(B3:IO_L42N_GCLK24_M3LDM_3) U14.E7(LDM)
DDR3_LDQS: U2.L4(B3:IO_L39P_M3LDQS_3) U14.F3(LDQS)
DDR3_LDQS#: U2.L3(B3:IO_L39N_M3LDQSN_3) U14.G3(LDQS#)
DDR3_ODT: U2.K6(B3:IO_L45N_M3ODT_3) U14.K1(ODT)
DDR3_RAS#: U2.L5(B3:IO_L43P_GCLK23_M3RASN_3) U14.J3(RAS#)
DDR3_RESET#: R43.2 U2.E4(B3:IO_L54P_M3RESET_3) U14.T2(RESET#)
DDR3_UDM: U2.K4(B3:IO_L42P_GCLK25_TRDY2_M3UDM_3) U14.D3(UDM)
DDR3_UDQS: U2.P2(B3:IO_L34P_M3UDQS_3) U14.C7(UDQS)
DDR3_UDQS#: U2.P1(B3:IO_L34N_M3UDQSN_3) U14.B7(UDQS#)
DDR3_WE#: U2.E3(B3:IO_L50P_M3WE_3) U14.L3(WE#)
GND: C56.2 C57.2 C58.2 C59.2 C60.2 C61.2 C62.2 C64.2 C65.2 C66.2 C72.2 R41.2 R42.1 R43.1 R44.1 R47.1 U14.A9(VSS) U14.B1(VSSQ) U14.B3(VSS) U14.B9(VSSQ) U14.D1(VSSQ) U14.D8(VSSQ) U14.E1(VSS) U14.E2(VSSQ) U14.E8(VSSQ) U14.F9(VSSQ) U14.G1(VSSQ) U14.G8(VSS) U14.G9(VSSQ) U14.J2(VSS) U14.J8(VSS) U14.L2(CS#) U14.M1(VSS) U14.M9(VSS) U14.P1(VSS) U14.P9(VSS) U14.T1(VSS) U14.T9(VSS) ; also sheet 1,2,3,4,5,7,8,9
M3_RZQ: R41.1 U2.L6(B3:IO_L31P_3)
N$3: R44.2 U14.L8(ZQ)
Unconnected: U2.C2(B3:IO_L83P_3) U2.F5(B3:IO_L55N_M3A14_3) U2.F6(B3:IO_L55P_M3A13_3) U2.N4(B3:IO_L1P_3) U2.P3(B3:IO_L2N_3) U2.P4(B3:IO_L2P_3) U14.J1(NC) U14.J9(NC) U14.L1(NC) U14.L9(NC) U14.M7(NC) U14.T3(NC) U14.T7(NC)

### Buses
DDR3_DQ[0..15]
DDR3_A[0..12]
DDR3_BA[0..2]

## Sheet 7 of 9: PMOD
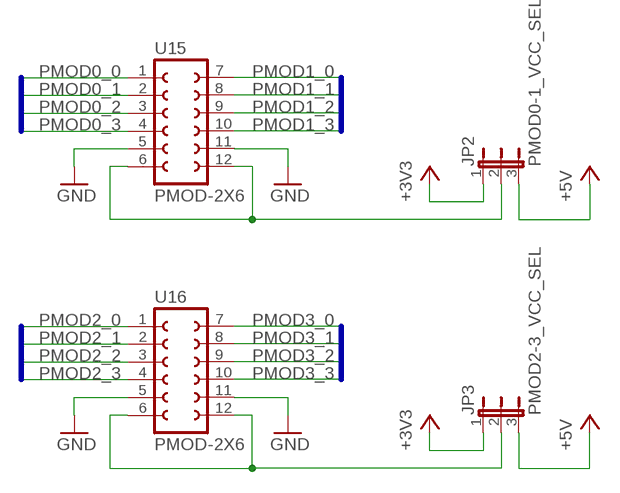
[diagram p6: schematic, sheet 7]

### Parts
JP2  PMOD0-1_VCC_SEL  JP2E  [JP2]
JP3  PMOD2-3_VCC_SEL  JP2E  [JP2]
U15  PMOD-2X6  [PMOD-2X6]
U16  PMOD-2X6  [PMOD-2X6]

### Nets
+3V3 [power]: JP2.1 JP3.1 ; also sheet 1,2,3,4,5,8,9
+5V [power]: JP2.3 JP3.3 ; also sheet 1,3,4,5
GND: U15.5 U15.11 U16.5 U16.11 ; also sheet 1,2,3,4,5,6,8,9
N$49: JP3.2 U16.6 U16.12
N$51: JP2.2 U15.6 U15.12
PMOD0_0: U15.1
PMOD0_1: U15.2
PMOD0_2: U15.3
PMOD0_3: U15.4
PMOD1_0: U15.7
PMOD1_1: U15.8
PMOD1_2: U15.9
PMOD1_3: U15.10
PMOD2_0: U16.1
PMOD2_1: U16.2
PMOD2_2: U16.3
PMOD2_3: U16.4
PMOD3_0: U16.7
PMOD3_1: U16.8
PMOD3_2: U16.9
PMOD3_3: U16.10

### Buses
PMOD0_[0..3]
PMOD1_[0..3]
PMOD2_[0..3]
PMOD3_[0..3]

## Sheet 8 of 9: Audio
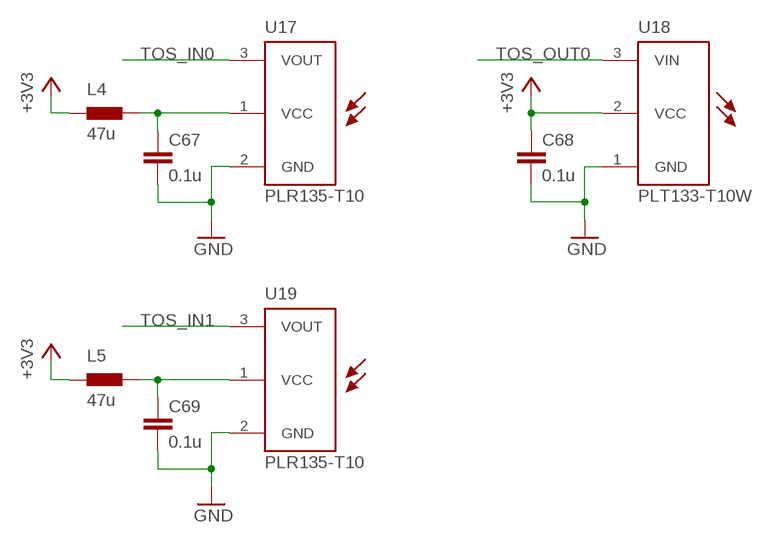
[diagram p7: schematic, sheet 8]

### Parts
C67  0.1u  CAPACITOR0402  [0402]
C68  0.1u  CAPACITOR0402  [0402]
C69  0.1u  CAPACITOR0402  [0402]
L4  47u  INDUCTOR0603  [0603]
L5  47u  INDUCTOR0603  [0603]
U17  PLR135-T10  [PLR135-T10_PLT133-T10W]
U18  PLT133-T10W  [PLR135-T10_PLT133-T10W]
U19  PLR135-T10  [PLR135-T10_PLT133-T10W]

### Nets
+3V3 [power]: C68.1 L4.1 L5.1 U18.2(VCC) ; also sheet 1,2,3,4,5,7,9
GND: C67.2 C68.2 C69.2 U17.2(GND) U18.1(GND) U19.2(GND) ; also sheet 1,2,3,4,5,6,7,9
N$4 [power]: C69.1 L5.2 U19.1(VCC)
N$36 [power]: C67.1 L4.2 U17.1(VCC)
TOS_IN0: U17.3(VOUT) ; also sheet 3
TOS_IN1: U19.3(VOUT) ; also sheet 4
TOS_OUT0: U18.3(VIN) ; also sheet 5

## Sheet 9 of 9: Bluetooth
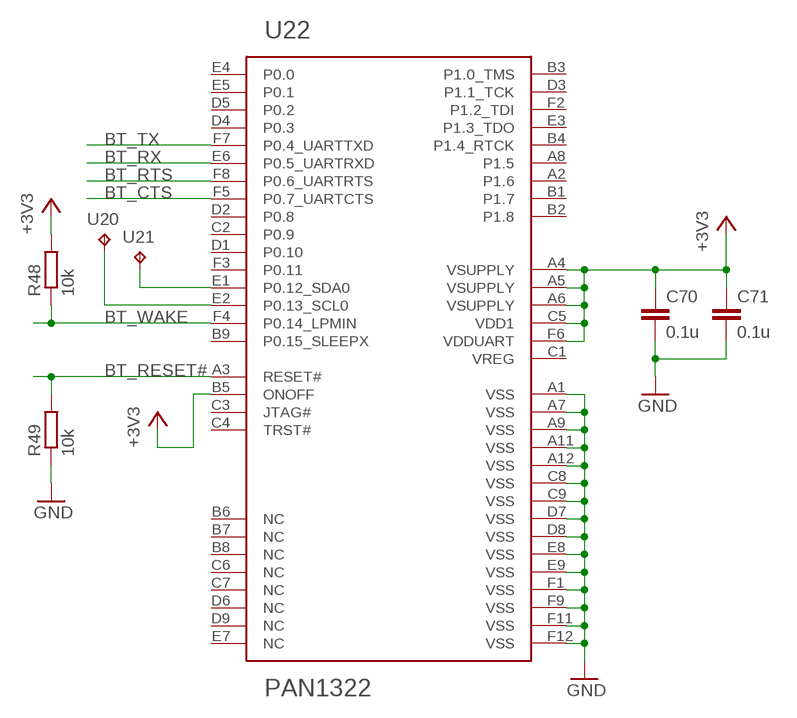
[diagram p8: schematic, sheet 9]

### Parts
C70  0.1u  CAPACITOR0402  [0402]
C71  0.1u  CAPACITOR0402  [0402]
R48  10k  RESISTOR0402  [0402]
R49  10k  RESISTOR0402  [0402]
U20  TP10SQ  [TP10SQ]
U21  TP10SQ  [TP10SQ]
U22  PAN1322  [PAN1322]

### Nets
+3V3 [power]: C70.1 C71.1 R48.2 U22.A4(VSUPPLY) U22.A5(VSUPPLY) U22.A6(VSUPPLY) U22.B5(ONOFF) U22.C5(VDD1) U22.F6(VDDUART) ; also sheet 1,2,3,4,5,7,8
BT_CTS: U22.F5(P0.7_UARTCTS) ; also sheet 4
BT_RESET#: R49.2 U22.A3(RESET#) ; also sheet 4
BT_RTS: U22.F8(P0.6_UARTRTS) ; also sheet 4
BT_RX: U22.E6(P0.5_UARTRXD) ; also sheet 4
BT_TX: U22.F7(P0.4_UARTTXD) ; also sheet 4
BT_WAKE: R48.1 U22.F4(P0.14_LPMIN) ; also sheet 4
GND: C70.2 C71.2 R49.1 U22.A1(VSS) U22.A7(VSS) U22.A9(VSS) U22.A11(VSS) U22.A12(VSS) U22.C8(VSS) U22.C9(VSS) U22.D7(VSS) U22.D8(VSS) U22.E8(VSS) U22.E9(VSS) U22.F1(VSS) U22.F9(VSS) U22.F11(VSS) U22.F12(VSS) ; also sheet 1,2,3,4,5,6,7,8
N$19: U21.TP U22.E1(P0.12_SDA0)
N$29: U20.TP U22.E2(P0.13_SCL0)
Unconnected: U22.A2(P1.6) U22.A8(P1.5) U22.B1(P1.7) U22.B2(P1.8) U22.B3(P1.0_TMS) U22.B4(P1.4_RTCK) U22.B6(NC) U22.B7(NC) U22.B8(NC) U22.B9(P0.15_SLEEPX) U22.C1(VREG) U22.C2(P0.9) U22.C3(JTAG#) U22.C4(TRST#) U22.C6(NC) U22.C7(NC) U22.D1(P0.10) U22.D2(P0.8) U22.D3(P1.1_TCK) U22.D4(P0.3) U22.D5(P0.2) U22.D6(NC) U22.D9(NC) U22.E3(P1.3_TDO) U22.E4(P0.0) U22.E5(P0.1) U22.E7(NC) U22.F2(P1.2_TDI) U22.F3(P0.11)

## Library data of the parts
C1 C2 C6 C9 C33 = pandaLight:CAPACITOR: generic capacitor; PARTNO: CL31A107MQHNNNE
C3 C7 C8 C10 C17-C19 C24 C28 C30 C32 C37 C44 C50 C56 = pandaLight:CAPACITOR: generic capacitor; PARTNO: C0603C475K9PACTU
C4 C5 C11-C13 C38 C39 C45 C46 C51 C52 C57 C58 = pandaLight:CAPACITOR: generic capacitor; PARTNO: C1005X5R0J474K050BB
C14-C16 C20-C23 C25-C27 C29 C31 C36 C40-C43 C47-C49 C53-C55 C61-C72 = pandaLight:CAPACITOR: generic capacitor; PARTNO: CL05B104KP5NNNC
C34 C35 = pandaLight:CAPACITOR: generic capacitor; PARTNO: CL05C270JB5NNNC
C59 C60 = pandaLight:CAPACITOR: generic capacitor; PARTNO: C1005X5R0J105M050BB
FB1 FB2 = pandaLight:FERRITE: generic ferrite bead; PARTNO: BK1005HS100-T
J1 = pandaLight:PJ-037A: DC Power Jack; PARTNO: PJ-037A
JP1-JP3 = pandaLight:JP2E: 3-pin jumper; BOM: EXCLUDE; PARTNO: *
L1-L3 = pandaLight:INDUCTOR: generic inductor; PARTNO: CIG22E1R0MNE
L4 L5 = pandaLight:INDUCTOR: generic inductor; PARTNO: GLFR1608T470M-LR
LED1 = pandaLight:LED: generic LED; PARTNO: LG Q971-KN-1
LED2 = pandaLight:LED: generic LED; PARTNO: LY Q976-P1S2-36
R1 R18 R27 R29 R31 R36 R46 R47 = pandaLight:RESISTOR: generic resistor; PARTNO: ERJ-2RKF1001X
R2-R4 = pandaLight:RESISTOR: generic resistor; PARTNO: ERJ-2RKF51R0X
R5 = pandaLight:RESISTOR: generic resistor; PARTNO: ERJ-2RKF3093X
R6 = pandaLight:RESISTOR: generic resistor; PARTNO: ERJ-2RKF7152X
R7 R8 R10 R12 R14 R16 = pandaLight:RESISTOR: generic resistor; PARTNO: ERJ-2RKF1003X
R9 = pandaLight:RESISTOR: generic resistor; PARTNO: ERJ-2RKF3163X
R11 = pandaLight:RESISTOR: generic resistor; PARTNO: ERJ-2RKF2213X
R13 = pandaLight:RESISTOR: generic resistor; PARTNO: ERJ-2RKF2743X
R15 = pandaLight:RESISTOR: generic resistor; PARTNO: ERJ-2RKF2943X
R17 R19 R20 R22-R25 R28 R30 R33 R35 R39 R48 R49 = pandaLight:RESISTOR: generic resistor; PARTNO: ERJ-2RKF1002X
R21 = pandaLight:RESISTOR: generic resistor; PARTNO: ERJ-2RKF1202X
R26 = pandaLight:RESISTOR: generic resistor; PARTNO: ERJ-2RKF2201X
R32 = pandaLight:RESISTOR: generic resistor; PARTNO: ERJ-2RKF2401X
R34 R38 R45 = pandaLight:RESISTOR: generic resistor; PARTNO: ERJ-2GEJ101X
R37 R40 R42 R43 = pandaLight:RESISTOR: generic resistor; PARTNO: ERJ-2RKF4701X
R41 = pandaLight:RESISTOR: generic resistor; PARTNO: ERJ-2RKF1200X
R44 = pandaLight:RESISTOR: generic resistor; PARTNO: ERJ-2RKF2400X
SV1 = pandaLight:MA02-1: 2-pin male header; BOM: EXCLUDE; PARTNO: *
SV2 = pandaLight:MA06-1: 6-pin male header; BOM: EXCLUDE; PARTNO: *
U1 = pandaLight:MIC23450: high-efficiency, 3 MHz, triple 2A, buck regulator; PARTNO: MIC23450-AAAYML TR
U2 = pandaLight:6SLX45: Xilinx FPGA: 6SLX45CSG324; PARTNO: XC6SLX45-3CSG324C
U3 = pandaLight:TPD4S014: Complete USB Port Protection Device; PARTNO: TPD4S014DSQR
U4 = pandaLight:FT2232H: FT2232H USB2.0 High speed dual Serial/FIFO controller 64 pin device; PARTNO: FT2232HL-REEL
U5 = pandaLight:93LC46BT-I: 1K Microwire Compatible Serial EEPROM; PARTNO: 93LC46BT-I/OT
U6 U7 U9 U10 = pandaLight:741C083: 4 element chip resistor array; PARTNO: 741C083510JP
U8 U11 U13 = pandaLight:TPD12S016: HDMI Companion Chip; PARTNO: TPD12S016PWR
U12 = pandaLight:N25Q128A: 128Mb, 3V, Multiple I/O Serial Flash Memory; PARTNO: N25Q128A13EF840E
U14 = pandaLight:AS4C128M16D3: 2Gb (128M x 16 bit) DDR3 Synchronous DRAM (SDRAM); PARTNO: AS4C128M16D3-12BCN
U15 U16 = pandaLight:PMOD-2X6: 2x6 PMOD connector; PARTNO: PPTC062LJBN-RC
U17 U19 = pandaLight:PLR135-T10: Photolink- Fiber Optic Receiver; PARTNO: PLR135/T10
U18 = pandaLight:PLT133-T10W: Photo-link Light Transmitter Unit; PARTNO: PLT133/T10W
U20 U21 = pandaLight:TP: generic test point; BOM: EXCLUDE; PARTNO: *
U22 = pandaLight:PAN1322: All-In-One, Place and Play Bluetooth Module; PARTNO: ENW-89841A3KF
X1 = pandaLight:USB: USB Connectors; PARTNO: 10118192-0001LF
X2-X4 = pandaLight:HDMI_RECEPTICAL: HDMI receptical; PARTNO: 10029449-111RLF
Y1 = pandaLight:403: Surface Mount Quartz Crystal; PARTNO: 403C35D12M00000
Y2 = pandaLight:636: HCMOS/TTL clock oscillator; PARTNO: 636L3C020M00000

## Net classes
1 power: width 0.127 mm, clearance 0.127 mm
2 tmds: width 0.127 mm, clearance 0.127 mm
3 ddr3_vref: width 0.127 mm, clearance 0.127 mm
4 vbus: width 0.254 mm, clearance 0.127 mm